# Altium schematic sheet [02] - BLOCK DIAGRAM.SchDoc
size Letter; Organization: Altium Limited; Address1: L3, 12a Rodborough Rd; Address2: Frenchs Forest; Address3: NSW; Address4: Australia 2086; SheetNumber: 2; SheetTotal: 5
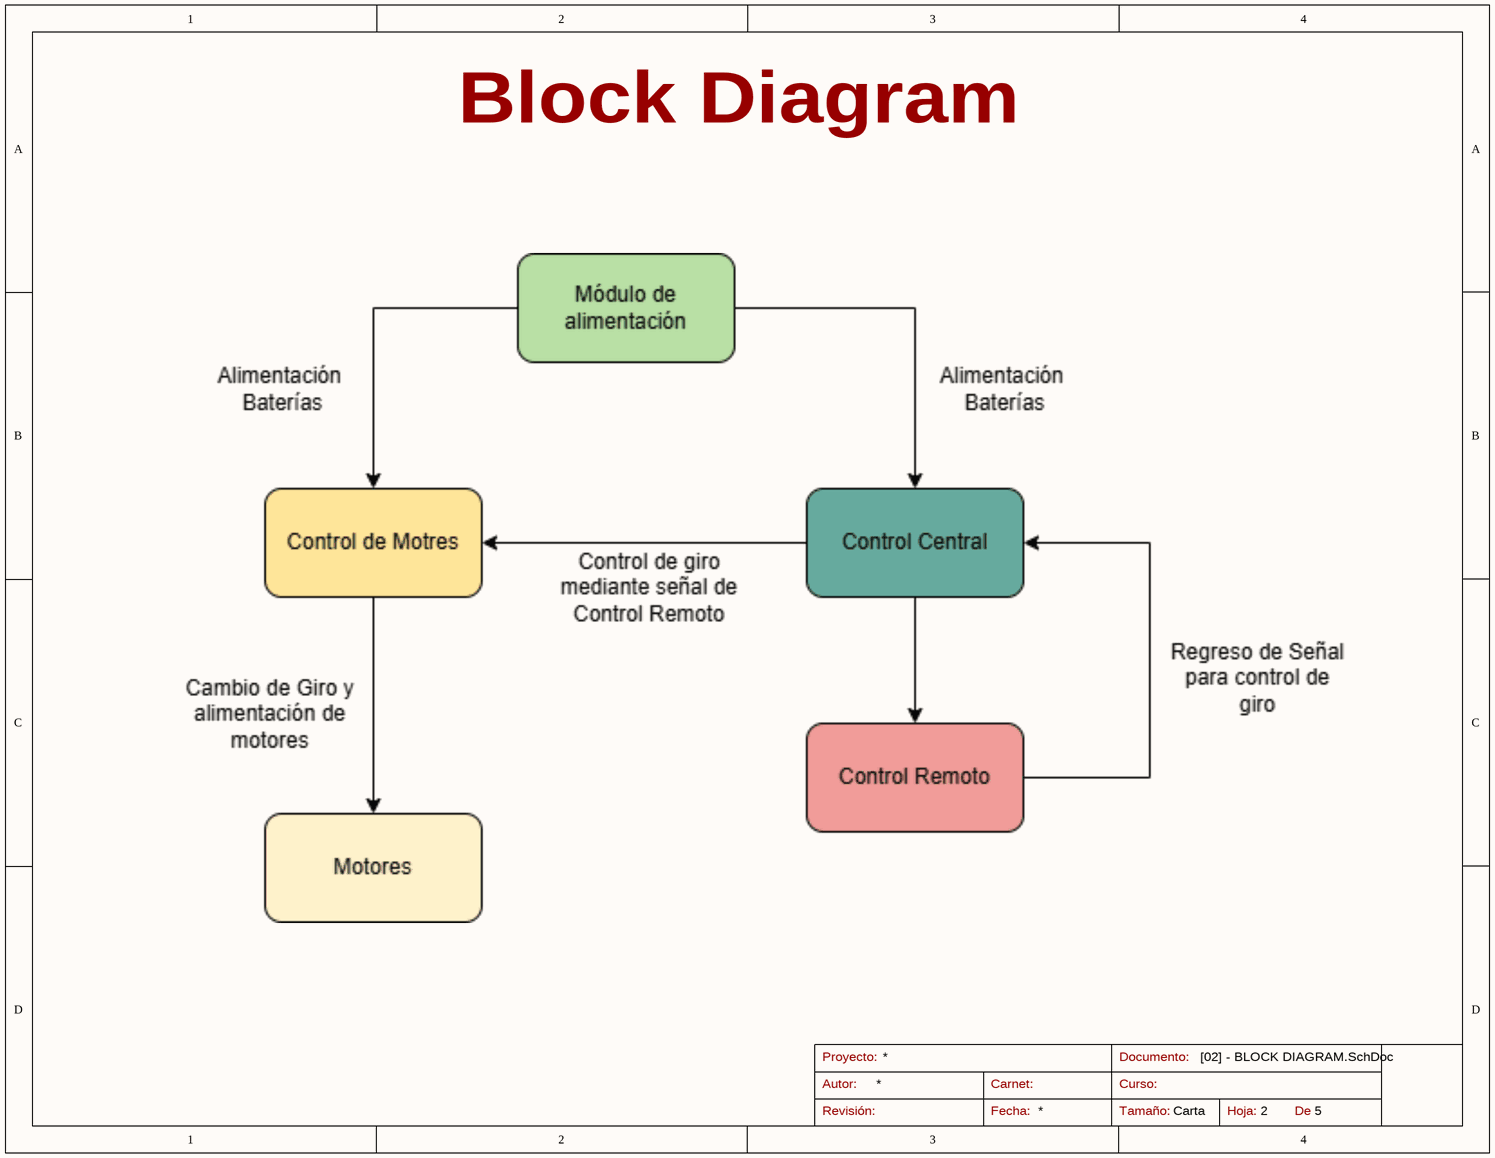
[diagram p0: [02] - BLOCK DIAGRAM.SchDoc]

## Notes on the sheet
- Block Diagram
- Proyecto:
- Autor:
- Carnet:
- Documento:
- Curso:
- Revisión:
- Fecha:
- Tamaño:
- Carta
- Hoja:
- De